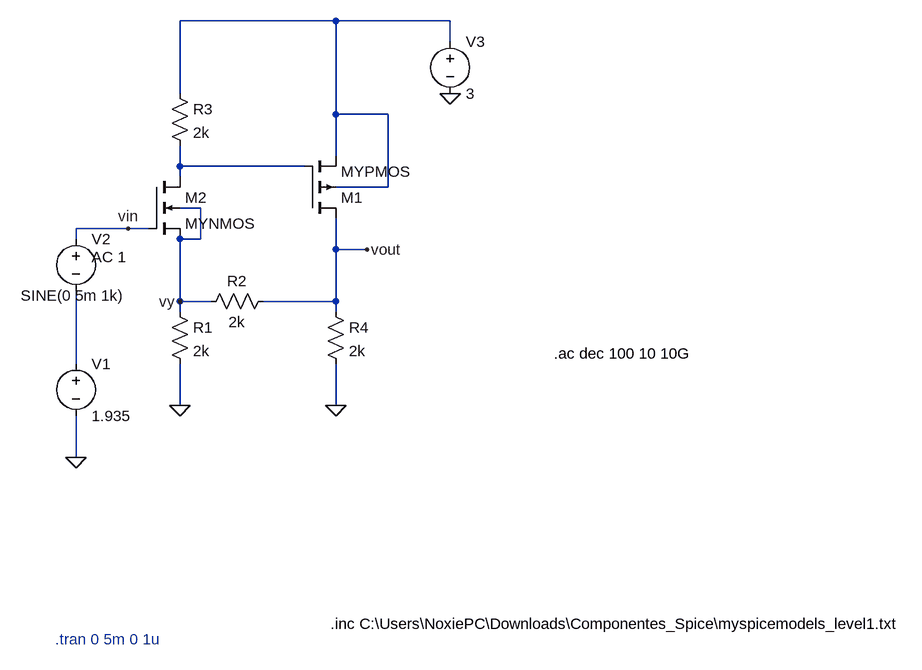
[diagram p0: schematic CircuitoconFeedback.asc]
CircuitoconFeedback.asc, the LTspice schematic file:
Version 4.1
SHEET 1 1180 680
WIRE 224 -848 -16 -848
WIRE 400 -848 224 -848
WIRE 400 -816 400 -848
WIRE -16 -736 -16 -848
WIRE 224 -704 224 -848
WIRE 304 -704 224 -704
WIRE 224 -640 224 -704
WIRE -16 -624 -16 -656
WIRE 176 -624 -16 -624
WIRE -16 -608 -16 -624
WIRE 304 -592 304 -704
WIRE 304 -592 224 -592
WIRE 16 -560 -16 -560
WIRE -96 -528 -176 -528
WIRE -64 -528 -96 -528
WIRE -176 -512 -176 -528
WIRE 16 -512 16 -560
WIRE 16 -512 -16 -512
WIRE 224 -496 224 -544
WIRE 272 -496 224 -496
WIRE -16 -416 -16 -512
WIRE 32 -416 -16 -416
WIRE 224 -416 224 -496
WIRE 224 -416 112 -416
WIRE -16 -400 -16 -416
WIRE 224 -400 224 -416
WIRE -176 -320 -176 -432
WIRE -16 -256 -16 -320
WIRE 224 -256 224 -320
WIRE -176 -176 -176 -240
FLAG -176 -176 0
FLAG -16 -256 0
FLAG 224 -256 0
FLAG 400 -736 0
FLAG 272 -496 vout
FLAG -96 -528 vin
FLAG -16 -416 vy
SYMBOL voltage -176 -336 R0
WINDOW 123 0 0 Left 0
WINDOW 39 0 0 Left 0
SYMATTR InstName V1
SYMATTR Value 1.935
SYMBOL voltage -176 -528 R0
WINDOW 3 -85 103 Left 2
WINDOW 123 24 44 Left 2
WINDOW 39 0 0 Left 0
SYMATTR InstName V2
SYMATTR Value SINE(0 5m 1k)
SYMATTR Value2 AC 1
SYMBOL nmos4 -64 -608 R0
SYMATTR InstName M2
SYMATTR Value MYNMOS
SYMATTR Value2 l=0.5u w=50u
SYMBOL res -32 -416 R0
SYMATTR InstName R1
SYMATTR Value 2k
SYMBOL res 128 -432 R90
WINDOW 0 0 56 VBottom 2
WINDOW 3 32 56 VTop 2
SYMATTR InstName R2
SYMATTR Value 2k
SYMBOL res -32 -752 R0
SYMATTR InstName R3
SYMATTR Value 2k
SYMBOL pmos4 176 -544 M180
SYMATTR InstName M1
SYMATTR Value MYPMOS
SYMATTR Value2 l=0.5u w=50u
SYMBOL res 208 -416 R0
SYMATTR InstName R4
SYMATTR Value 2k
SYMBOL voltage 400 -832 R0
WINDOW 123 0 0 Left 0
WINDOW 39 0 0 Left 0
SYMATTR InstName V3
SYMATTR Value 3
TEXT 216 80 Left 2 !.inc C:\\Users\\NoxiePC\\Downloads\\Componentes_Spice\\myspicemodels_level1.txt
TEXT -208 104 Left 2 ;.tran 0 5m 0 1u
TEXT 560 -336 Left 2 !.ac dec 100 10 10G

The netlist it stands for:
* CircuitoconFeedback.asc
V1 N003 0 1.935
V2 vin N003 SINE(0 5m 1k) AC 1
M2 N002 vin vy vy MYNMOS l=0.5u w=50u
R1 vy 0 2k
R2 vout vy 2k
R3 N001 N002 2k
M1 vout N002 N001 N001 MYPMOS l=0.5u w=50u
R4 vout 0 2k
V3 N001 0 3
.model NMOS NMOS
.model PMOS PMOS
.lib standard.mos
.inc C:\Users\NoxiePC\Downloads\Componentes_Spice\myspicemodels_level1.txt
* .tran 0 5m 0 1u
.ac dec 100 10 10G
.backanno
.end